# Altium schematic sheet LTC4041_Battery Power Management IC.SchDoc: Battery Power Management IC
size A4
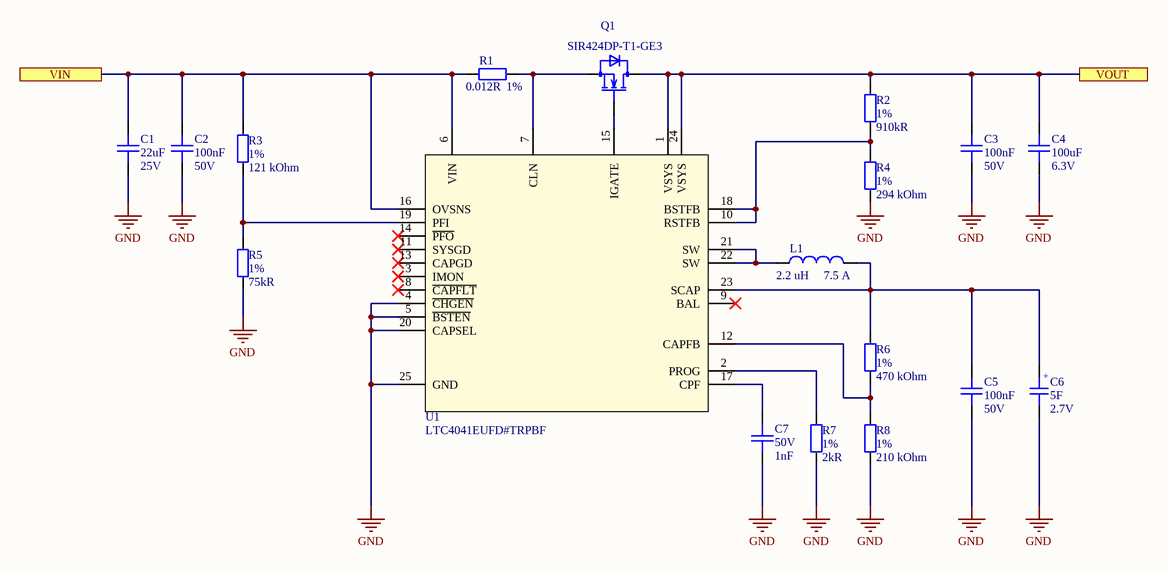
[diagram p0: LTC4041_Battery Power Management IC.SchDoc]

## Parts
C1  Capacitance: 22uF  Voltage Rating: 25V  [C0805]  (hidden comment: CAP CER 22UF 25V X5R 0805)
C2  Capacitance: 100nF  Voltage: 50V  [C0402]  (hidden comment: CAP CER 0.1UF 50V X7R 0402)
C3  Capacitance: 100nF  Voltage: 50V  [C0402]  (hidden comment: CAP CER 0.1UF 50V X7R 0402)
C4  Capacitance: 100uF  Voltage Rating: 6.3V  [C1206]  (hidden comment: CAP CER 100UF 6.3V X5R 1206)
C5  Capacitance: 100nF  Voltage: 50V  [C0402]  (hidden comment: CAP CER 0.1UF 50V X7R 0402)
C6  Capacitance: 5F  Voltage Rating: 2.7V  [CAPASITOR_10]  (hidden comment: CAP 5F 0% +100% 2.7V T/H)
C7  Voltage Rating (DC): 50V  Capacitance: 1nF  [C0402]  (hidden comment: CAP CER 1000PF 50V X7R 0402)
L1  Inductance: 2.2 uH  Maximum DC Current: 7.5 A  [IND_WE_MAPI]  (hidden comment: FIXED IND 2.2UH 7.5A 16.1MOHM SM)
Q1  SIR424DP-T1-GE3  [PowerPAK® SO-8]
R1  Tolerance: 1%  Resistance: 0.012R  [R2512]  (hidden comment: RES 0.012 OHM 1% 3W 2512)
R2  Tolerance: 1%  Resistance: 910kR  [R0402]  (hidden comment: RES SMD 910K OHM 1% 1/16W 0402)
R3  Tolerance: 1%  Resistance: 121 kOhm  [R0402]  (hidden comment: RES SMD 121K OHM 1% 1/16W 0402)
R4  Tolerance: 1%  Resistance: 294 kOhm  [R0402]  (hidden comment: RES SMD 294K OHM 1% 1/16W 0402)
R5  Tolerance: 1%  Resistance: 75kR  [R0402]  (hidden comment: RES SMD 75K OHM 1% 1/16W 0402)
R6  Tolerance: 1%  Resistance: 470 kOhm  [R0402]  (hidden comment: RES SMD 470K OHM 1% 1/16W 0402)
R7  Tolerance: 1%  Resistance: 2kR  [R0402]  (hidden comment: RC0402FR-072KL)
R8  Tolerance: 1%  Resistance: 210 kOhm  [R0402]  (hidden comment: RES SMD 210K OHM 1% 1/16W 0402)
U1  LTC4041EUFD#TRPBF  [QFN24_4X5]

## Ports
VIN, VOUT

## Nets
GND: C1.1 C2.1 C3.1 C4.1 C5.1 C6.2 C7.1 R4.1 R5.1 R7.1 R8.1 U1.4(~{CHGEN}) U1.5(~{BSTEN}) U1.20(CAPSEL) U1.25(GND)
VIN: C1.2 C2.2 R1.1 R3.2 U1.6(VIN) U1.16(OVSNS) ; port VIN
VOUT: C3.2 C4.2 Q1.3(D) R2.1 U1.1(VSYS) U1.24(VSYS) ; port VOUT
NetC5_2: C5.2 C6.1 L1.2 R6.2 U1.23(SCAP)
NetC7_2: C7.2 U1.17(CPF)
NetL1_1: L1.1 U1.21(SW) U1.22(SW)
NetQ1_1: Q1.1(G) U1.15(IGATE)
NetQ1_2: Q1.2(S) R1.2 U1.7(CLN)
NetR2_2: R2.2 R4.2 U1.10(RSTFB) U1.18(BSTFB)
NetR3_1: R3.1 R5.2 U1.19(PFI)
NetR6_1: R6.1 R8.2 U1.12(CAPFB)
NetR7_2: R7.2 U1.2(PROG)

Not connected (* = marked no-connect by the designer): U1 3(IMON)* 8(~{CAPFLT})* 9(BAL)* 11(SYSGD)* 13(CAPGD)* 14(~{PFO})*

## Notes on the sheet
- Title
- Size:
- Date:
- A4
- Number:
- Time:
- Revision:
- Sheet
- of
- File:
- (in symbol CAP 5F 0% +100% 2.7V T/H) +

## Library data of the parts
C1 = CAP CER 22UF 25V X5R 0805: 22µF ±20% 25V Ceramic Capacitor X5R 0805 (2012 Metric); Manufacturer: Yageo; Manufacturer Part Number: CC0805MKX5R8BB226; Supplier 1: Digi-Key; Stock 1: 1060; Pricing 1: 1=0.5, 10=0.353, 50=0.267, 100=0.2325, 500=0.1722, 1000=0.1464 (USD); Mount: Surface Mount; Case/Package: 0805; Weight: 0.000194oz; Case Code (Metric): 2012; Case Code (Imperial): 0805; Min Operating Temperature: -55°C; Max Operating Temperature: 85°C; Packaging: Tape and Reel; Tolerance: 20%; Dielectric: X5R; Termination: SMD/SMT; Voltage Rating (DC): 25V; Package Quantity: 3000; Length: 0.079inch; Height: 1.25mm; Width: 0.049inch; Thickness: 0.057inch; Lead Free: Lead Free; Halogen Free: Halogen Free; ComponentLink1URL: http://www.yageo.com/documents/recent/UPY-GPHC_X5R_4V-to-50V_25.pdf?src-supplier=Digi-Key; ComponentLink1Description: http://www.yageo.com/documents/recent/UPY-GPHC_X5R_4V-to-50V_25.pdf?src-supplier=Digi-Key; ComponentLink2URL: http://www.mouser.com/ds/2/447/Yageo_UPY-GP_NP0_16V-to-50V_9-358835.pdf?src-supplier=Mouser; ComponentLink2Description: http://www.mouser.com/ds/2/447/Yageo_UPY-GP_NP0_16V-to-50V_9-358835.pdf?src-supplier=Mouser; Supplier Part Number 1: 311-1903-1-ND
C2 C3 C5 = CAP CER 0.1UF 50V X7R 0402: 0.1µF ±10% 50V Ceramic Capacitor X7R 0402 (1005 Metric); Manufacturer: TDK; Manufacturer Part Number: CGA2B3X7R1H104K050BB; Supplier 1: Digi-Key; Stock 1: 2925303; Pricing 1: 1=0.17, 10=0.118, 50=0.0668, 100=0.0553, 500=0.0388, 1000=0.0321, 2500=0.0299, 5000=0.0273 (USD); Mount: Surface Mount; Case/Package: 0402; Weight: 2.3E-05oz; Case Code (Metric): 1005; Case Code (Imperial): 0402; Min Operating Temperature: -55°C; Max Operating Temperature: 125°C; Voltage Rating: 50V; Tolerance: 10%; Packaging: Tape and Reel; Package Quantity: 1; Voltage Rating (DC): 50V; Dielectric: X7R; Termination: SMD/SMT; Composition: Ceramic; Length: 1mm; Height: 0.5mm; Width: 0.02inch; Thickness: 0.022inch; Depth: 0.5mm; Ratings: AEC-Q200; REACH SVHC: No SVHC; Lead Free: Lead Free; ComponentLink1URL: http://product.tdk.com/capacitor/mlcc/en/documents/mlccspec_automotive_general_midvoltage_en.pdf?src-supplier=Future+Electronics; ComponentLink1Description: http://product.tdk.com/capacitor/mlcc/en/documents/mlccspec_automotive_general_midvoltage_en.pdf?src-supplier=Future+Electronics; ComponentLink2URL: http://www.farnell.com/datasheets/1807242.pdf?src-supplier=Element14; ComponentLink2Description: http://www.farnell.com/datasheets/1807242.pdf?src-supplier=Element14; ComponentLink3URL: http://www.mouser.com/ds/2/400/lcc_automotive_general_en-843974.pdf?src-supplier=Mouser; ComponentLink3Description: http://www.mouser.com/ds/2/400/lcc_automotive_general_en-843974.pdf?src-supplier=Mouser; ComponentLink4URL: http://www.farnell.com/datasheets/1936565.pdf?src-supplier=Element14; ComponentLink4Description: http://www.farnell.com/datasheets/1936565.pdf?src-supplier=Element14; ComponentLink5URL: http://www.farnell.com/datasheets/1735392.pdf?src-supplier=Element14; ComponentLink5Description: http://www.farnell.com/datasheets/1735392.pdf?src-supplier=Element14; Supplier Part Number 1: 445-6899-1-ND
C4 = CAP CER 100UF 6.3V X5R 1206: 100 µF ±20% 6.3V Ceramic Capacitor X5R 1206 (3216 Metric); Manufacturer: Yageo; Manufacturer Part Number: CC1206MKX5R5BB107; Supplier 1: Digi-Key; Stock 1: 3990; Pricing 1: 1=0.49, 10=0.348, 50=0.2632, 100=0.2293, 500=0.1698, 1000=0.1444 (USD); Mount: Surface Mount; Case/Package: 1206; Weight: 0.000571oz; Case Code (Imperial): 1206; Case Code (Metric): 3216; Min Operating Temperature: -55°C; Max Operating Temperature: 85°C; Tolerance: 20%; Packaging: Tape and Reel; Voltage Rating (DC): 6.3V; Dielectric: X5R; Termination: SMD/SMT; Composition: Ceramic; Length: 3.2mm; Width: 1.6mm; Thickness: 0.071inch; Depth: 1.6mm; Radiation Hardening: No; Lead Free: Lead Free; Halogen Free: Halogen Free; ComponentLink1URL: https://www.digikey.com/en/products/detail/yageo/CC1206MKX5R5BB107/5195397?s=N4IgjCBcpgbFoDGUBmBDANgZwKYBoQB7KAbRAA4BmAdjAgF0CAHAFyhAGUWAnASwDsA5iAC%2BBAEwAGACwBOBCGSR02fEVLhJkgAQBWgGIhGIVuwCq-XiwDyKALI40WAK7ccoggFoI0Raky4BMSQZGCURiKRQA; ComponentLink1Description: https://www.digikey.com/en/products/detail/yageo/CC1206MKX5R5BB107/5195397?s=N4IgjCBcpgbFoDGUBmBDANgZwKYBoQB7KAbRAA4BmAdjAgF0CAHAFyhAGUWAnASwDsA5iAC%2BBAEwAGACwBOBCGSR02fEVLhJkgAQBWgGIhGIVuwCq-XiwDyKALI40WAK7ccoggFoI0Raky4BMSQZGCURiKRQA; Supplier Part Number 1: 13-CC1206MKX5R5BB107TR-ND
C6 = CAP 5F 0% +100% 2.7V T/H: 5 F (EDLC) Supercapacitor 2.7 V Radial, Can 70mOhm @ 1kHz 1000 Hrs @ 60°C; Manufacturer: AVX Corporation; Manufacturer Part Number: SCCS20B505PRB; ESR (Equivalent Series Resistance): 70mR; Supplier 1: Digi-Key; Pricing 1: 1=2.02, 10=1.634, 50=1.4256, 100=1.2474, 500=0.9504, 1000=0.8316, 2500=0.8019, 5000=0.7722 (USD); Mount: Through Hole; Min Operating Temperature: -40°C; Max Operating Temperature: 65°C; Packaging: Tape and Reel; Voltage Rating (DC): 2.7V; Termination: PC Pins; Height: 20mm; ComponentLink1URL: https://www.digikey.com/en/products/detail/avx-corporation/SCCS20B505PRB/6166274; ComponentLink1Description: https://www.digikey.com/en/products/detail/avx-corporation/SCCS20B505PRB/6166274; Supplier Part Number 1: 478-10013-ND
C7 = CAP CER 1000PF 50V X7R 0402: 1000pF ±10% 50V Ceramic Capacitor X7R 0402 (1005 Metric); Manufacturer: TDK-Lambda; Manufacturer Part Number: C0402C102K5RACTU; Supplier 1: Digi-Key; Stock 1: 1578852; Pricing 1: 1=0.1, 10=0.021, 50=0.0116, 100=0.0095, 500=0.0068, 1000=0.0053, 2500=0.0048, 5000=0.0045 (USD); Case/Package: 0402; Number of Pins: 2; Dielectric Material: Ceramic; Dielectric: X7R; Packaging: Cut Tape; Tolerance: 10%; Length: 1mm; Height: 500um; Width: 500um; REACH SVHC: No SVHC; ComponentLink1URL: http://www.onlinecomponents.com/productFiles/mf-KEM/kem_c1002_x7r_smd.pdf?src-supplier=Onlinecomponents.com; ComponentLink1Description: http://www.onlinecomponents.com/productFiles/mf-KEM/kem_c1002_x7r_smd.pdf?src-supplier=Onlinecomponents.com; Supplier Part Number 1: 399-1032-6-ND; Mount: Surface Mount
L1 = FIXED IND 2.2UH 7.5A 16.1MOHM SM: 2.2 µH Shielded - Inductor 7.5 A 16.1mOhm Max Nonstandard -; Manufacturer: Wurth Elektronik; Manufacturer Part Number: 74438367022; Self Resonant Frequency: 28 MHz; Tolerance: 20 %; RoHS: RoHS Compliant; Category: Fixed Inductors; Stock 1: 2000; Pricing 1: 1=0.730, 10=0.721, 50=0.601, 100=0.457, 1000=0.397, 2000=0.385 (USD); Application: Power; Height: 3.1 mm; Length: 5.4 mm; Maximum DC Resistance: 16.1 mOhms; Packaging: Cut Tape; Product: Fixed Inductors; Series: WE-MAPI; Shielding: Shielded; Termination Style: SMD/SMT; Width: 5.4 mm; Brand: Wurth Elektronik; Mounting Style: PCB Mount; Maximum Operating Temperature: + 125 C; Minimum Operating Temperature: - 40 C; Product Type: Fixed Inductors; Saturation Current: 7.5 A; Standard Pack Qty: 700; Subcategory: Inductors, Chokes & Coils; Termination: -; RoHS - Mouser: Y; Minimum Order Quantity: 1; Reeling: True; ComponentLink1URL: https://www.digikey.com/en/products/detail/würth-elektronik/74438367022/11657904?s=N4IgTCBcDaIOwBYEGYAcyBscAMYIF0BfIA; ComponentLink1Description: https://www.digikey.com/en/products/detail/würth-elektronik/74438367022/11657904?s=N4IgTCBcDaIOwBYEGYAcyBscAMYIF0BfIA; Supplier 2: Digi-Key; Supplier Part Number 1: 732-74438367022TR-ND; Mount: Surface Mount
Q1 = MOSFET N-CH 20V 30A PPAK SO-8: N-Channel 20 V 30A (Tc) 4.8W (Ta), 41.7W (Tc) Surface Mount PowerPAK® SO-8; Manufacturer: Vishay Siliconix; Drain to Source Voltage (Vdss): 20V; Rds On Max: 5.5mR; Rise Time: 10ns; Input Capacitance: 1250pF; Max Power Dissipation: 4.8mW; Turn-On Delay Time: 18ns; Turn-Off Delay Time: 23ns; Fall Time: 7ns; Gate to Source Voltage (Vgs): 8V; Number of Channels: 1; Supplier 1: Digi-Key; Manufacturer Part Number: SIR424DP-T1-GE3; Stock 1: 12407; Pricing 1: 1=0.37, 10=0.306, 25=0.2564, 100=0.1254, 250=0.1234, 500=0.1046, 1000=0.0727 (USD); Mount: Surface Mount; Case/Package: PowerPAK® SO-8; Number of Pins: 3; Weight: 0.004395oz; Contact Plating: Tin; Min Operating Temperature: -55°C; Max Operating Temperature: 150°C; Packaging: Tape and Reel; Max Dual Supply Voltage: 20V; Continuous Drain Current (ID): 30A; Drain to Source Breakdown Voltage: 20V; Drain to Source Resistance: 5.5mR; Package Quantity: 3000; Halogen Free: Halogen Free; REACH SVHC: No SVHC; Lead Free: Lead Free; ComponentLink1URL: http://www.infineon.com/dgdl/BSS816NW_Rev2.3_.pdf?folderId=db3a3043156fd573011622e10b5c1f67&fileId=db3a304335113a6301351e704a2e1332&src-supplier=Avnet; ComponentLink1Description: http://www.infineon.com/dgdl/BSS816NW_Rev2.3_.pdf?folderId=db3a3043156fd573011622e10b5c1f67&fileId=db3a304335113a6301351e704a2e1332&src-supplier=Avnet; Supplier Part Number 1: SIR424DP-T1-GE3TR-ND
R1 = RES 0.012 OHM 1% 3W 2512: 12 mOhms ±1% 3W Chip Resistor 2512 (6432 Metric) Current Sense Metal Element; Manufacturer: Stackpole Electronics Inc; Manufacturer Part Number: CSM2512FT12L0; Voltage Rating: 200V; Temperature Coefficient: 50ppm/°C; Supplier 1: Digi-Key; Stock 1: 5005874; Pricing 1: 1=0.1, 10=0.014, 100=0.0058, 1000=0.0026, 2500=0.0023, 5000=0.0019 (USD); Case/Package: 2512; Number of Pins: 2; Weight: 2.3E-05oz; Case Code (Imperial): 2512; Case Code (Metric): 6432; Min Operating Temperature: -55°C; Max Operating Temperature: 155°C; Power Rating: 3W; Packaging: Tape and Reel; Package Quantity: 1; Termination: SMD/SMT; Resistor Type: Thick Film; Number of Terminations: 2; Features: Moisture Resistant; Voltage Rating (DC): 200V; REACH SVHC: No SVHC; Military Standard: Not; Lead Free: Lead Free; ComponentLink1URL: https://www.digikey.com/en/products/detail/stackpole-electronics-inc/CSM2512FT12L0/6270235; ComponentLink1Description: https://www.digikey.com/en/products/detail/stackpole-electronics-inc/CSM2512FT12L0/6270235; Supplier Part Number 1: CSM2512FT12L0-ND; Mount: Surface Mount
R2 = RES SMD 910K OHM 1% 1/16W 0402: 910 kOhms ±1% 0.063W, 1/16W Chip Resistor 0402 (1005 Metric) Moisture Resistant Thick Film; Manufacturer: Yageo; Manufacturer Part Number: RC0402FR-07910KL; Power Rating: 62.5mW; Voltage Rating: 50V; Temperature Coefficient: 100ppm/°C; Max Power Dissipation: 63mW; Supplier 1: Digi-Key; Stock 1: 96210; Pricing 1: 1=0.1, 10=0.015, 100=0.0062, 1000=0.0028, 2500=0.0024, 5000=0.002 (USD); Case/Package: 0402; Case Code (Imperial): 0402; Case Code (Metric): 1005; Contact Plating: Tin,Matte; Min Operating Temperature: -55°C; Max Operating Temperature: 155°C; Packaging: Tape and Reel; Composition: Thick Film; Termination: SMD/SMT; Number of Terminations: 2; Military Standard: Not; Voltage Rating (DC): 50V; Features: Moisture Resistant; Length: 1mm; Height: 0.016inch; Width: 0.5mm; Depth: 0.5mm; REACH SVHC: Unknown; Lead Free: Lead Free; ComponentLink1URL: http://www.yageo.com/documents/recent/PYu-RC0402_51_RoHS_L_6.pdf?src-supplier=Avnet+Europe; ComponentLink1Description: http://www.yageo.com/documents/recent/PYu-RC0402_51_RoHS_L_6.pdf?src-supplier=Avnet+Europe; ComponentLink2URL: https://www.verical.com/server-webapp/html/getDatasheet?partID=741075&src-supplier=Verical; ComponentLink2Description: https://www.verical.com/server-webapp/html/getDatasheet?partID=741075&src-supplier=Verical; ComponentLink3URL: http://www.yageo.com/documents/recent/PYu-RC0402_51_RoHS_L_6.pdf?src-supplier=Avnet; ComponentLink3Description: http://www.yageo.com/documents/recent/PYu-RC0402_51_RoHS_L_6.pdf?src-supplier=Avnet; Supplier Part Number 1: YAG3257CT-ND
R3 = RES SMD 121K OHM 1% 1/16W 0402: 121 kOhms ±1% 0.063W, 1/16W Chip Resistor 0402 (1005 Metric) Moisture Resistant Thick Film; Manufacturer: Yageo; Manufacturer Part Number: RC0402FR-07121KL; Temperature Coefficient: 100ppm/°C; Power Rating: 63mW; Voltage Rating: 50V; Supplier 1: Digi-Key; Stock 1: 47448883; Pricing 1: 1=0.1, 10=0.016, 100=0.0064, 1000=0.0029, 2500=0.0025, 5000=0.0021 (USD); Case Code (Metric): 1005; Case Code (Imperial): 0402; Min Operating Temperature: -55°C; Max Operating Temperature: 155°C; Composition: Thick Film; Packaging: Tape and Reel; Package Quantity: 1; Number of Terminations: 2; Termination: SMD/SMT; Military Standard: Not; Max Power Dissipation: 63mW; Working Voltage: 50V; Features: Moisture Resistant; Length: 0.039inch; Height: 0.016inch; Width: 0.02inch; Depth: 0.5mm; REACH SVHC: No SVHC; Lead Free: Lead Free; ComponentLink1URL: https://www.digikey.com/en/products/detail/yageo/RC0402FR-07121KL/726536?s=N4IgTCBcDaIEoGEAMAWJYBicC0SDsAjGAQNIAyIAugL5A; ComponentLink1Description: https://www.digikey.com/en/products/detail/yageo/RC0402FR-07121KL/726536?s=N4IgTCBcDaIEoGEAMAWJYBicC0SDsAjGAQNIAyIAugL5A; Supplier Part Number 1: 311-121KLRTR-ND; Case/Package: 0402; ClassName: TCPP; Mount: Surface Mount
R4 = RES SMD 294K OHM 1% 1/16W 0402: 294 kOhms ±1% 0.063W, 1/16W Chip Resistor 0402 (1005 Metric) Moisture Resistant Thick Film; Manufacturer: Yageo; Manufacturer Part Number: RC0402FR-07294KL; Temperature Coefficient: 100ppm/°C; Power Rating: 63mW; Voltage Rating: 50V; Supplier 1: Digi-Key; Stock 1: 47448883; Pricing 1: 1=0.1, 10=0.016, 100=0.0064, 1000=0.0029, 2500=0.0025, 5000=0.0021 (USD); Case Code (Metric): 1005; Case Code (Imperial): 0402; Min Operating Temperature: -55°C; Max Operating Temperature: 155°C; Composition: Thick Film; Packaging: Tape and Reel; Package Quantity: 1; Number of Terminations: 2; Termination: SMD/SMT; Military Standard: Not; Max Power Dissipation: 63mW; Working Voltage: 50V; Features: Moisture Resistant; Length: 0.039inch; Height: 0.016inch; Width: 0.02inch; Depth: 0.5mm; REACH SVHC: No SVHC; Lead Free: Lead Free; ComponentLink1URL: https://www.digikey.com/en/products/detail/yageo/RC0402FR-07210KL/726560?s=N4IgTCBcDaIEoGEAMAWJYBicC0SDsYAjEgNIAyIAugL5A; ComponentLink1Description: https://www.digikey.com/en/products/detail/yageo/RC0402FR-07210KL/726560?s=N4IgTCBcDaIEoGEAMAWJYBicC0SDsYAjEgNIAyIAugL5A; Supplier Part Number 1: YAG3092TR-ND; Case/Package: 0402; ClassName: TCPP; Mount: Surface Mount
R5 = RES SMD 75K OHM 1% 1/16W 0402: 75 kOhms ±1% 0.063W, 1/16W Chip Resistor 0402 (1005 Metric) Automotive AEC-Q200 Thick Film; Manufacturer: Stackpole Electronics; Manufacturer Part Number: RMCF0402FT75K0; Power Rating: 63mW; Temperature Coefficient: 100ppm/°C; Supplier 1: Digi-Key; Stock 1: 24693; Pricing 1: 1=0.1, 10=0.014, 100=0.0058, 1000=0.0026, 2500=0.0023, 5000=0.0019 (USD); Mount: Surface Mount; Case/Package: 0402; Case Code (Metric): 1005; Case Code (Imperial): 0402; Contact Plating: Tin,Matte; Min Operating Temperature: -55°C; Max Operating Temperature: 155°C; Features: Automotive AEC-Q200; Packaging: Tape and Reel; Composition: Thick Film; Number of Terminations: 2; Military Standard: Not; Max Power Dissipation: 63mW; Length: 0.039inch; Height: 0.016inch; Width: 0.02inch; Depth: 0.5mm; Radiation Hardening: No; Lead Free: Lead Free; ComponentLink1URL: https://www.seielect.com/catalog/SEI-Packaging.pdf?src-supplier=Digi-Key; ComponentLink1Description: https://www.seielect.com/catalog/SEI-Packaging.pdf?src-supplier=Digi-Key; ComponentLink2URL: http://www.seielect.com/Catalog/Sei-RMC.pdf?src-supplier=Future+Electronics; ComponentLink2Description: http://www.seielect.com/Catalog/Sei-RMC.pdf?src-supplier=Future+Electronics; ComponentLink3URL: https://www.seielect.com/catalog/SEI-RMCF_RMCP.pdf?src-supplier=Avnet; ComponentLink3Description: https://www.seielect.com/catalog/SEI-RMCF_RMCP.pdf?src-supplier=Avnet; ComponentLink4URL: http://components.arrow.com/part/dataview/47811039S7743759N1174?src-supplier=Arrow; ComponentLink4Description: http://components.arrow.com/part/dataview/47811039S7743759N1174?src-supplier=Arrow; ComponentLink5URL: https://www.verical.com/server-webapp/html/getDatasheet?partID=492569&src-supplier=Verical; ComponentLink5Description: https://www.verical.com/server-webapp/html/getDatasheet?partID=492569&src-supplier=Verical; Supplier Part Number 1: RMCF0402FT75K0CT-ND; ClassName: STM32G473CETx
R6 = RES SMD 470K OHM 1% 1/16W 0402: 470 kOhms ±1% 0.063W, 1/16W Chip Resistor 0402 (1005 Metric) Moisture Resistant Thick Film; Manufacturer: Yageo; Manufacturer Part Number: RC0402FR-07470KL; Temperature Coefficient: 100ppm/°C; Power Rating: 63mW; Voltage Rating: 50V; Supplier 1: Digi-Key; Stock 1: 47448883; Pricing 1: 1=0.1, 10=0.016, 100=0.0064, 1000=0.0029, 2500=0.0025, 5000=0.0021 (USD); Case Code (Metric): 1005; Case Code (Imperial): 0402; Min Operating Temperature: -55°C; Max Operating Temperature: 155°C; Composition: Thick Film; Packaging: Tape and Reel; Package Quantity: 1; Number of Terminations: 2; Termination: SMD/SMT; Military Standard: Not; Max Power Dissipation: 63mW; Working Voltage: 50V; Features: Moisture Resistant; Length: 0.039inch; Height: 0.016inch; Width: 0.02inch; Depth: 0.5mm; REACH SVHC: No SVHC; Lead Free: Lead Free; ComponentLink1URL: https://www.digikey.com/en/products/detail/yageo/RC0402FR-07470KL/726618?s=N4IgTCBcDaIEoGEAMAWJYBicC0SDsKeSA0gDIgC6AvkA; ComponentLink1Description: https://www.digikey.com/en/products/detail/yageo/RC0402FR-07470KL/726618?s=N4IgTCBcDaIEoGEAMAWJYBicC0SDsKeSA0gDIgC6AvkA; Supplier Part Number 1: 311-470KLRTR-ND; Case/Package: 0402; ClassName: TCPP; Mount: Surface Mount
R7 = RES SMD 2K OHM 1% 1/16W 0402: 2 kOhms ±1% 0.063W, 1/16W Chip Resistor 0402 (1005 Metric) Moisture Resistant Thick Film; Manufacturer: Yageo; Value: 2k; Temperature Coefficient: 100ppm/°C; Power Rating: 62.5mW; Voltage Rating: 50V; Supplier 1: Digi-Key; Manufacturer Part Number: RC0402FR-072KL; Stock 1: 9574509; Pricing 1: 1=0.1, 10=0.015, 100=0.0062, 1000=0.0028, 2500=0.0024, 5000=0.002 (USD); Case/Package: 0402; Case Code (Metric): 1005; Case Code (Imperial): 0402; Min Operating Temperature: -55°C; Max Operating Temperature: 155°C; Packaging: Tape and Reel; Composition: Thick Film; Length: 1mm; Height: 0.32mm; Width: 0.5mm; ComponentLink1URL: https://www.digikey.com/en/products/detail/yageo/RC0402FR-072KL/2827565?s=N4IgTCBcDaIEoGEAMAWJYBicC0SDsYA0gDIgC6AvkA; ComponentLink1Description: https://www.digikey.com/en/products/detail/yageo/RC0402FR-072KL/2827565?s=N4IgTCBcDaIEoGEAMAWJYBicC0SDsYA0gDIgC6AvkA; Supplier Part Number 1: 311-2KLRTR-ND; Termination: SMD/SMT; Military Standard: Not; Depth: 0.5mm; Lead Free: Lead Free; Voltage Rating (DC): 50V; REACH SVHC: Unknown; Number of Pins: 2
R8 = RES SMD 210K OHM 1% 1/16W 0402: 210 kOhms ±1% 0.063W, 1/16W Chip Resistor 0402 (1005 Metric) Moisture Resistant Thick Film; Manufacturer: Yageo; Manufacturer Part Number: RC0402FR-07210KL; Temperature Coefficient: 100ppm/°C; Power Rating: 63mW; Voltage Rating: 50V; Supplier 1: Digi-Key; Stock 1: 47448883; Pricing 1: 1=0.1, 10=0.016, 100=0.0064, 1000=0.0029, 2500=0.0025, 5000=0.0021 (USD); Case Code (Metric): 1005; Case Code (Imperial): 0402; Min Operating Temperature: -55°C; Max Operating Temperature: 155°C; Composition: Thick Film; Packaging: Tape and Reel; Package Quantity: 1; Number of Terminations: 2; Termination: SMD/SMT; Military Standard: Not; Max Power Dissipation: 63mW; Working Voltage: 50V; Features: Moisture Resistant; Length: 0.039inch; Height: 0.016inch; Width: 0.02inch; Depth: 0.5mm; REACH SVHC: No SVHC; Lead Free: Lead Free; ComponentLink1URL: https://www.digikey.com/en/products/detail/yageo/RC0402FR-07210KL/726560?s=N4IgTCBcDaIEoGEAMAWJYBicC0SDsYAjEgNIAyIAugL5A; ComponentLink1Description: https://www.digikey.com/en/products/detail/yageo/RC0402FR-07210KL/726560?s=N4IgTCBcDaIEoGEAMAWJYBicC0SDsYAjEgNIAyIAugL5A; Supplier Part Number 1: 311-210KLRTR-ND; Case/Package: 0402; ClassName: TCPP; Mount: Surface Mount
U1 = IC LTC4041EUFD#TRPBF BATT PWR MGMT MULTI 1C 24QFN: Battery Power Management IC Multi-Chemistry 24-QFN (4x5); Manufacturer: Analog Devices Inc.; Product Status: New Product; Manufacturer Part Number: LTC4041EUFD#TRPBF; RoHS: RoHS Compliant; Category: PMIC - Battery Management; Stock 1: 208; Pricing 1: 1=4.41, 10=3.96, 100=3.34, 250=2.91, 500=2.76, 1000=2.33, 2500=2.21, 5000=2.13 (USD); Packaging: Cut Tape; Standard Pack Qty: 2500; Minimum Order Quantity: 1; ComponentLink1URL: https://www.digikey.com/en/products/detail/analog-devices-inc/LTC4041EUFD-TRPBF/9446043; ComponentLink1Description: https://www.digikey.com/en/products/detail/analog-devices-inc/LTC4041EUFD-TRPBF/9446043; Supplier Part Number 1: 161-LTC4041EUFD#TRPBFTR-ND; Mount: Surface Mount